# EAGLE design Grove - SPDT Relay(30A) v1.0 (EAGLE 6.3)
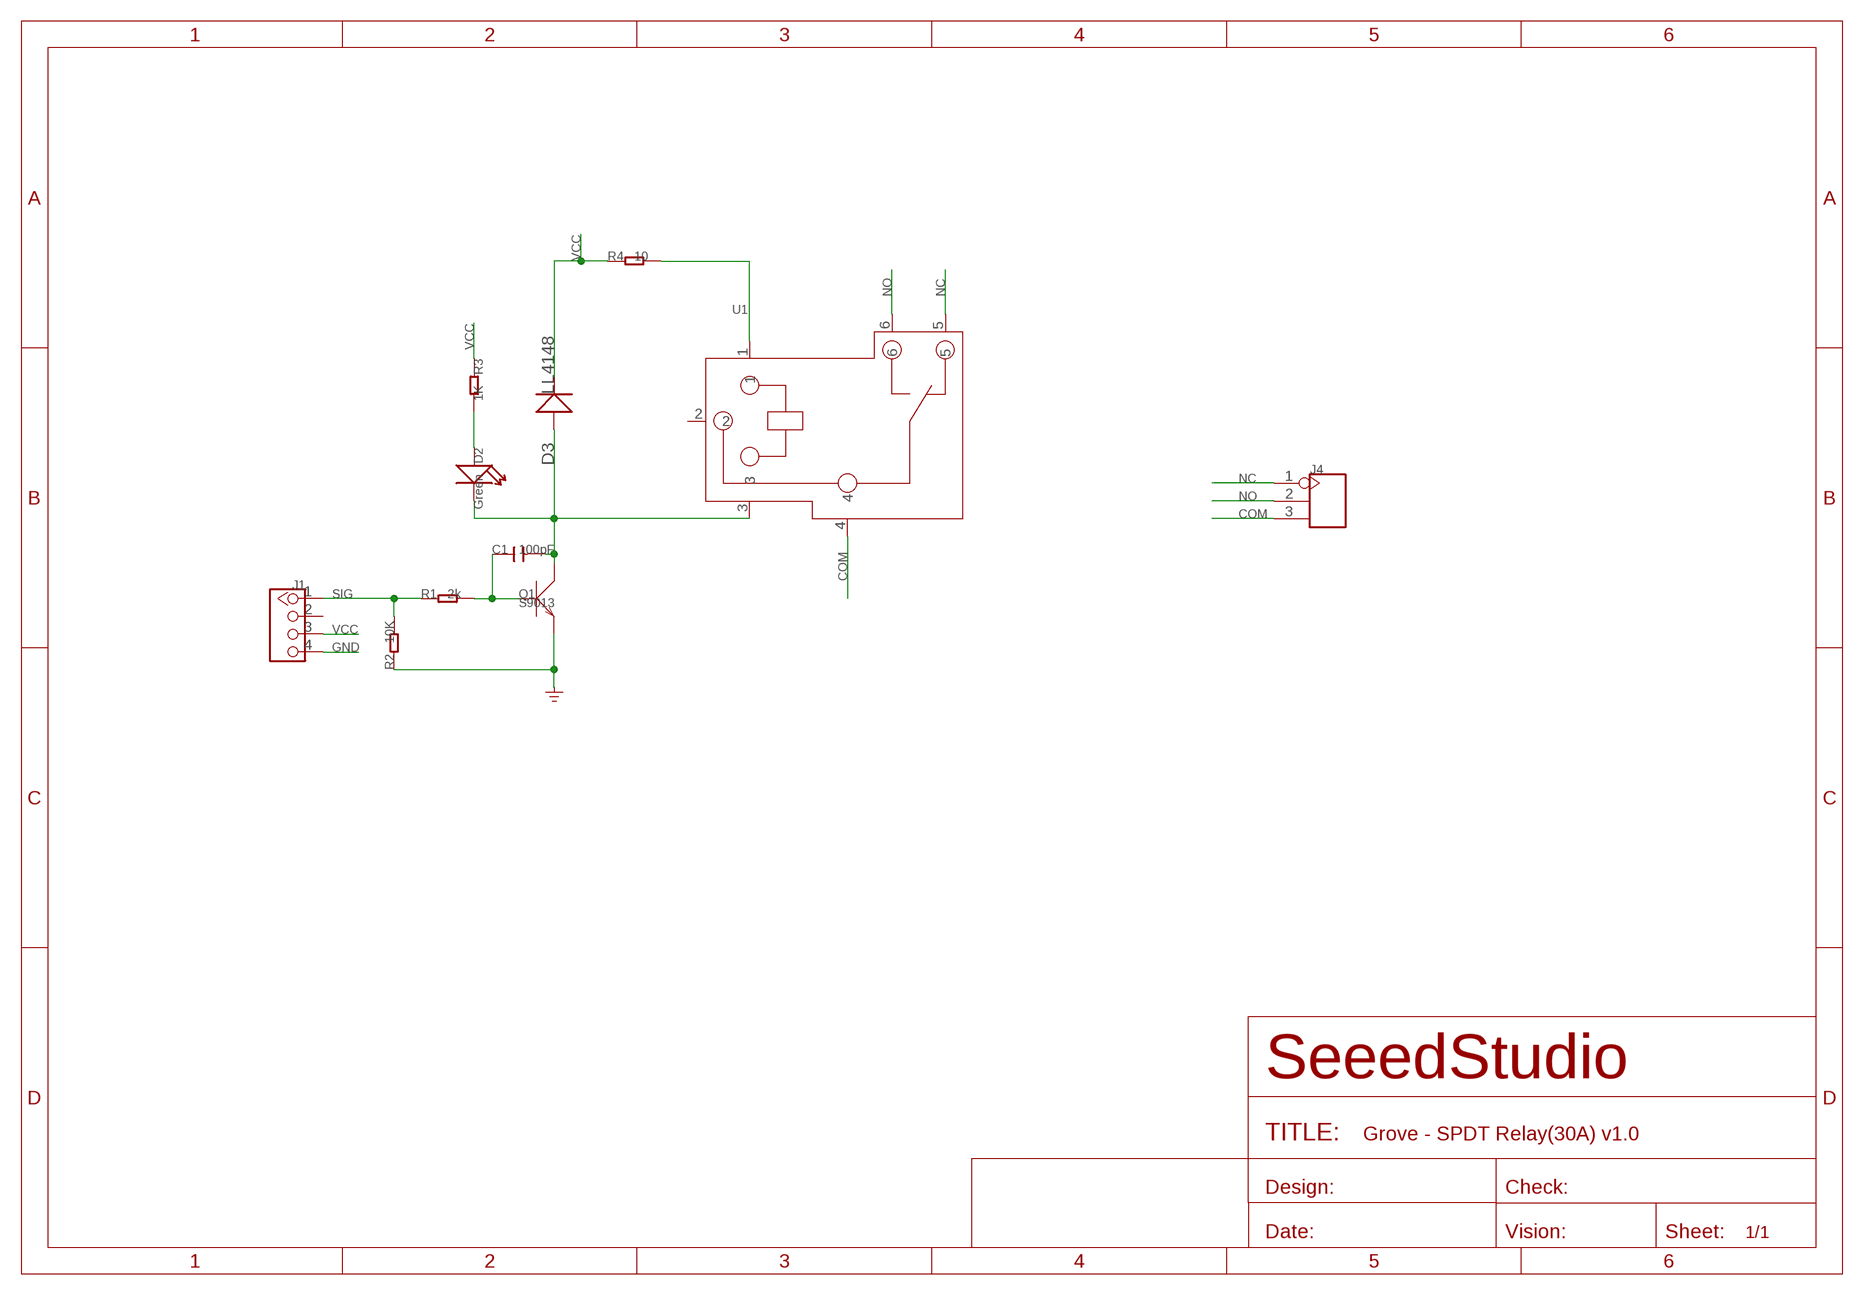
[diagram p0: schematic, sheet 1]

## Parts
C1  100pF  C-0603  [C0603]
D2  Green  LED'0603'  [LED-0603]
D3  LL4148  D'1N4148-SMD'  [DO-35-SMD]
J1  TWIG-4P-2.0-2.0  [4P-2.0]
J4  SCREW-TERMINAL-3P'5.08'  [3P-5.08]
Q1  S9013  TRANSISTOR-NPN-SOT23  [SOT23]
R1  2k  R-0603  [R0603]
R2  10K  R-0603  [R0603]
R3  1K  R-0603  [R0603]
R4  10  R-0603  [R0603]
U1  RELAY-SLA-05VDC-SL-C  [6P-19.8H]

## Nets
COM: J4.3 U1.4
GND: J1.4 Q1.2(E) R2.1
N$1: C1.1 Q1.1(B) R1.2
N$2: D2.+ R3.2
N$3: C1.2 D2.- D3.A(+) Q1.3(C) U1.3
N$7: R4.2 U1.1
NC: J4.1 U1.5
NO: J4.2 U1.6
SIG: J1.1 R1.1 R2.2
VCC: D3.C(-) J1.3 R3.1 R4.1
Unconnected: J1.2 U1.2

## Library data of the parts
C1 = Discrete:C*: Ceramic Capacitors
D2 = Discrete:LED*
D3 = Discrete:D*
J1 = Connector:TWIG-4P-2.0
J4 = Connector:SCREW-TERMINAL-3P
Q1 = Discrete:TRANSISTOR-NPN*: NPN audion
R1-R4 = Discrete:R*
U1 = template:RELAY-SLA-05VDC-SL-C: · Up to 30A switching in SPST and 20A switching in spot arrangements. · Available as an open-frame relay, with a snap-on dust cover or with an immersion cleanable, plastic sealed case.

## Board
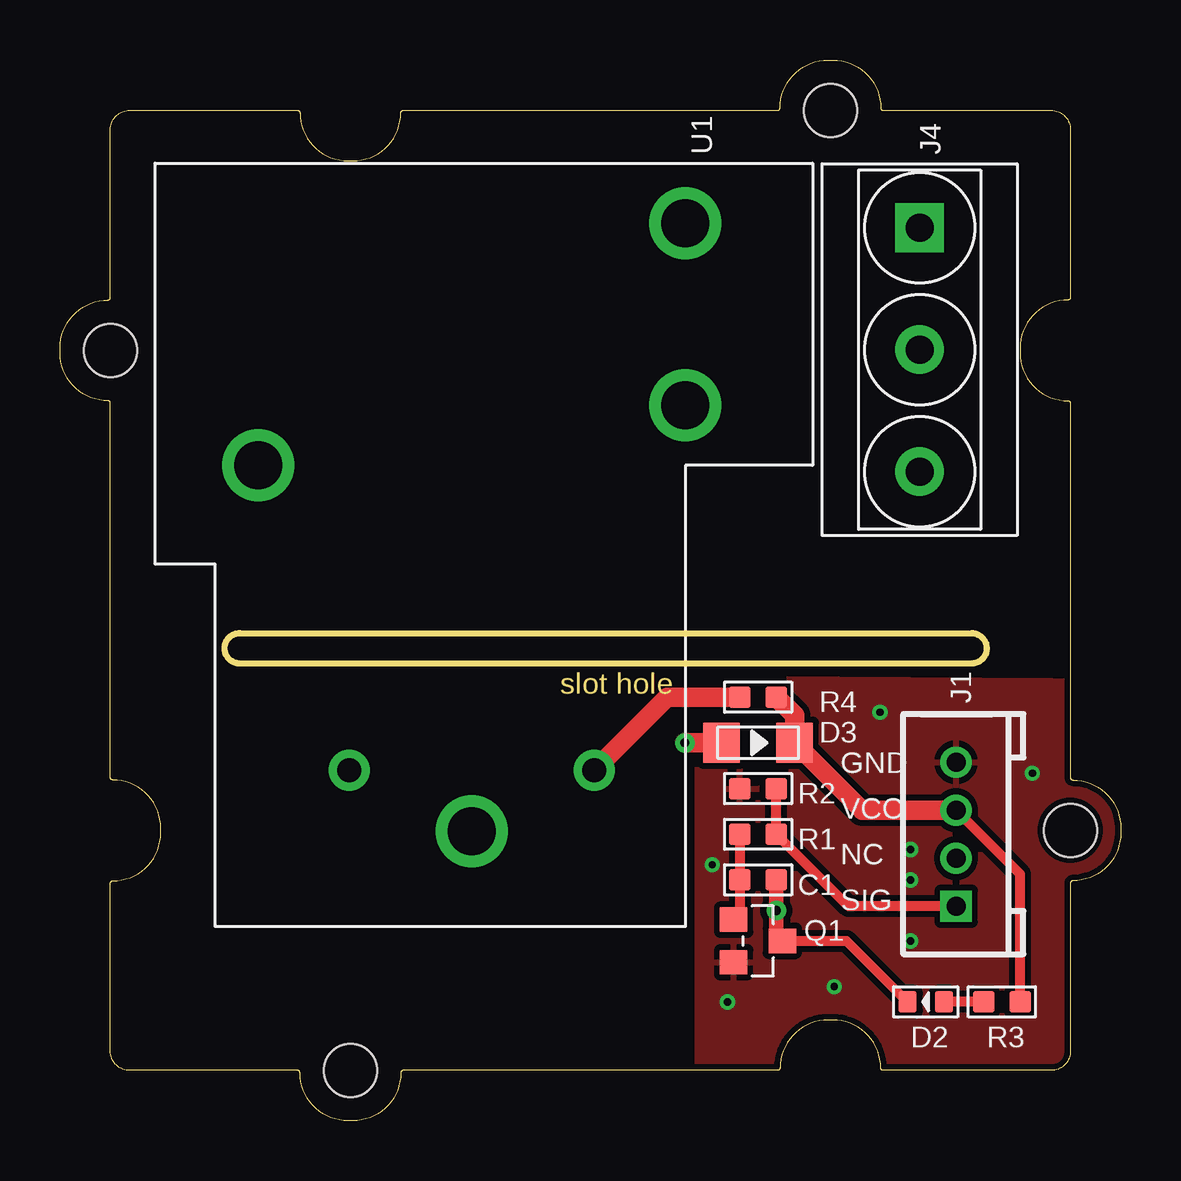
[diagram p1: board, top side]
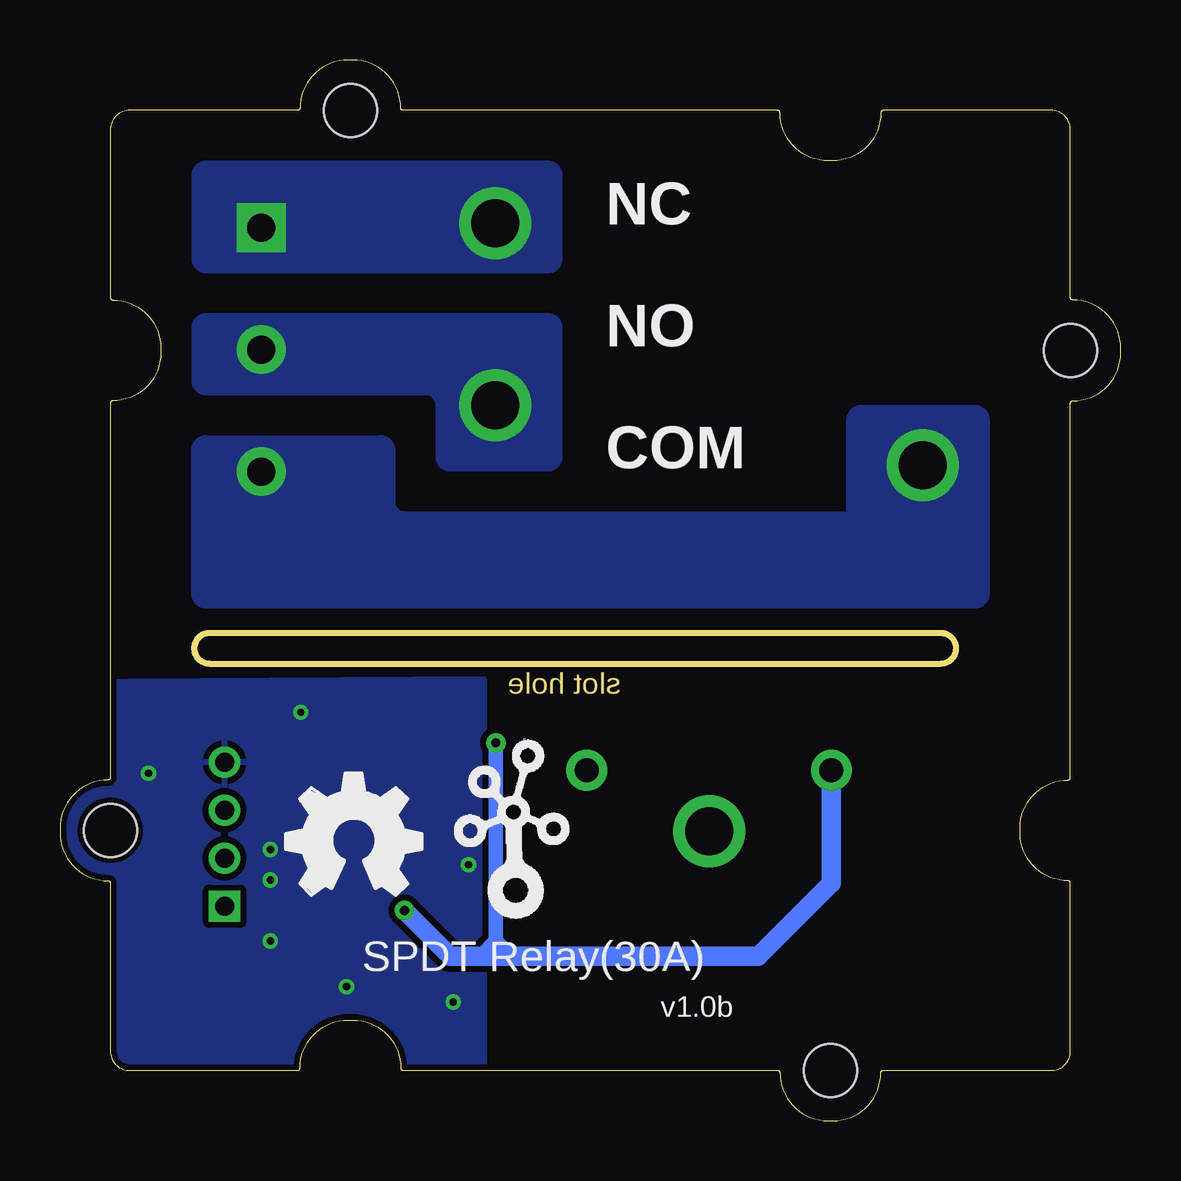
[diagram p2: board, bottom side, seen from below]

Size 44.2 x 44.2 mm. Coordinates in mm from the lower left corner, seen from the top.
Copper layers (1*16): Top 0.035mm / dielectric 1.5mm / Bottom 0.035mm
Design rules "SeeedStudio_rule_no_angle_090911 *": minimum track width 6mil, minimum drill 12mil, track to track 6mil, track to pad 6mil, pad to pad 6mil, via to via 6mil, smd to smd 0mil, copper to edge 10mil, drill to drill 10mil, minimum pad ring 10mil, minimum via ring 6mil, stop-mask expansion 2mil, vias tented up to drill 25mil, thermal gap 10mil
Milling: area 6.9,19.1 to 38.6,20.3

### Footprints (pad centres in the part's own frame; a part is rotated, then mirrored left to right if it is on the bottom)
C0603 = smd 0.889 x 0.889: 1 -0.762,0; 2 0.762,0
LED-0603 = smd 0.762 x 0.889: + -0.762,0; - 0.762,0
DO-35-SMD = smd 1.524 x 1.676: A -1.524,0; C 1.524,0
4P-2.0 = drill 0.8 pad 1.27 square: 1 -3,0 | drill 0.8 pad 1.27: 2 -1,0; 3 1,0; 4 3,0
3P-5.08 = drill 1.168 pad 2.032 square: 1 0,5.08 | drill 1.168 pad 2.032: 2 0,0; 3 0,-5.08
SOT23 = smd 1.016 x 1.143: 1 -0.889,-1.016; 2 0.889,-1.016; 3 0,1.016
R0603 = smd 0.889 x 0.889: 1 -0.762,0; 2 0.762,0
6P-19.8H = drill 1 pad 1.7: 1 -9.4,-4.6; 3 -9.4,5.6 | drill 2 pad 3: 2 -11.94,0.5; 4 3.3,9.4; 5 13.4,-8.4; 6 5.8,-8.4
2X2U-DIM-W/-DRILL = hole 2.2: 10,20; -20,10; -10,-20; 20,-10

### Placement (x,y rotation side)
C1  29.09,10.04 0 top
D2  36.07,4.96 180 top
D3  29.09,15.75 0 top
J1  37.34,11.94 90 top
J4  35.82,32.13 0 top
Q1  29.09,7.5 270 top
R1  29.09,11.94 180 top
R2  29.09,13.85 0 top
R3  39.25,4.96 180 top
R4  29.09,17.66 180 top
U1  17.66,24.01 90 top
U$3  [2X2U-DIM-W/-DRILL]  22.1,22.1 0 top
U$4  [OSHW_FILLX200_NOTEXT]  34.8,9.4 0 bottom
U$5  [TWIGLOGO]  25.28,9.4 0 bottom

### Tracks (layer width: path | path; a pad name or v marks a point on that pad's centre or on a via)
COM
  pour Bottom (isolate 0.254, no thermals): 5.59,29.21 5.59,21.97 arc90 6.1,21.46 38.1,21.46 arc90 38.61,21.97 38.61,27.94 arc90 38.1,28.45 30.86,28.45 arc90 30.36,27.94 30.36,25.78 arc-90 29.85,25.28 11.31,25.28 11.31,29.21 arc90 10.8,29.72 6.1,29.72 arc90
GND  (via drill 0.3 pad 0.64)
  other vias: 35.44,11.31 35.44,10.04 32.26,5.59 34.16,17.02 35.44,7.5 40.52,14.48 27.82,4.96 27.18,10.67
  pour Bottom (isolate 0.254): 26.55,1.91 44.33,1.78 44.33,18.29 26.55,18.42
  pour Top (isolate 0.254, rank 6): 26.55,1.91 44.33,1.78 44.33,18.29 26.55,18.42
N$1
  Top 0.406: R1.2 C1.1 28.32,8.64 Q1.1
N$2
  Top 0.406: R3.2 D2.+
N$3  (via drill 0.38 pad 0.81)
  Top 0.406: 29.85,7.75 29.97,7.62 Q1.3 32.77,7.5 D2.-
  Top 0.61: C1.2 v29.85,8.77 29.85,7.5 29.97,7.62
  Top 0.813: D3.A v26.04,15.75
  Bottom 0.61: v26.04,15.75 26.04,7.75 26.04,7.5 | 26.04,7.5 26.04,6.86 | 26.04,7.5 25.4,6.86 | 26.04,7.5 26.67,6.86
  Bottom 0.813: v29.85,8.77 27.94,6.86 26.67,6.86 26.04,6.86 25.4,6.86 15.12,6.86 12.07,9.91 U1.3
N$7
  Top 0.813: R4.2 25.3,17.66 U1.1
NC
  pour Bottom (isolate 0.254, no thermals): 38.61,39.37 38.61,35.94 arc-90 38.1,35.44 23.88,35.44 arc-90 23.37,35.94 23.37,39.37 arc-90 23.88,39.88 38.1,39.88 arc-90
NO
  pour Bottom (isolate 0.254, no thermals): 38.61,33.02 38.61,30.86 arc-90 38.1,30.36 28.96,30.36 arc90 28.45,29.85 28.45,27.69 arc-90 27.94,27.18 23.88,27.18 arc-90 23.37,27.69 23.37,33.02 arc-90 23.88,33.53 38.1,33.53 arc-90
SIG
  Top 0.406: J1.1 32.85,8.94 R1.1 R2.2
VCC
  Top 0.406: R3.1 40.01,10.27 J1.3
  Top 0.813: J1.3 33.42,12.94 D3.C 30.61,16.89 R4.1

### Text on the board
tPlace: GND | VCC | NC | SIG
bPlace: NC | NO | COM | SPDT Relay(30A) | v1.0b
Milling: slot hole